# EAGLE design PennyMan_Ard_R3_Shield_v8 (EAGLE 7.6.0)
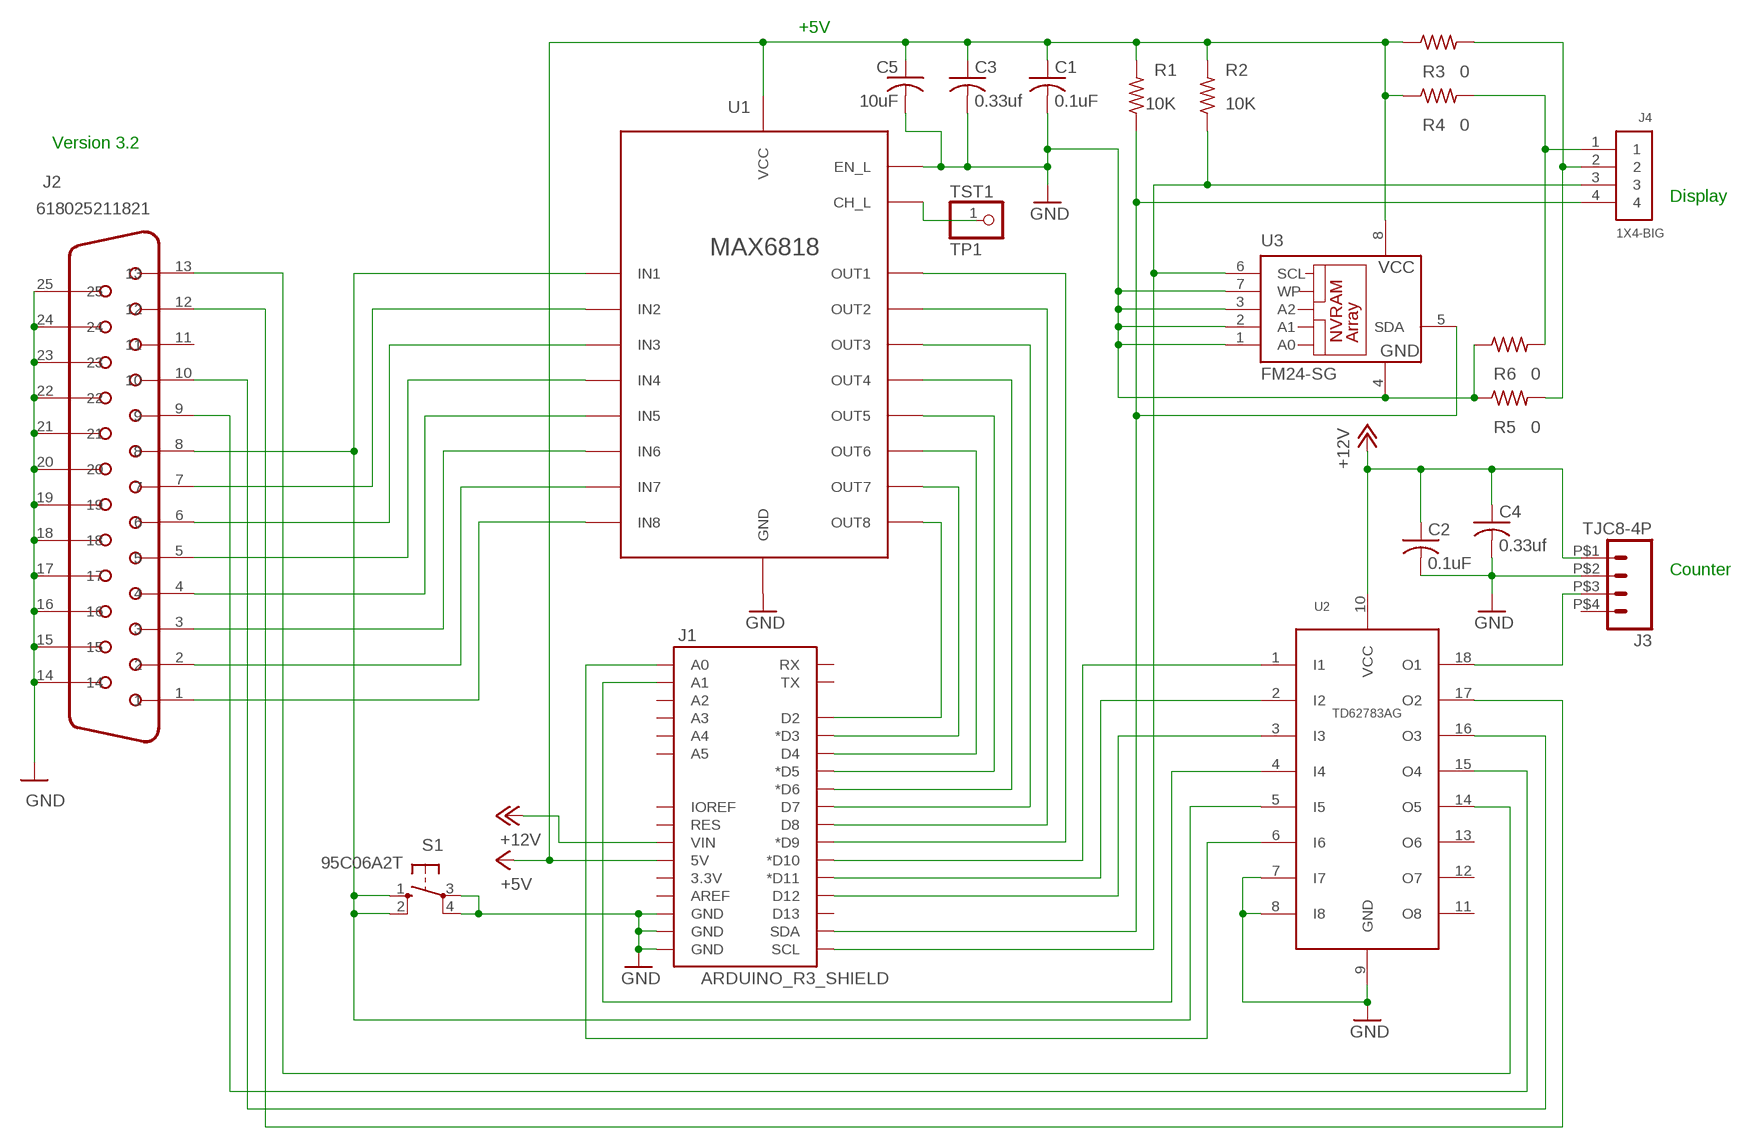
[diagram p0: schematic, sheet 1]

## Parts
C1  0.1uF  C-USC0805  [C0805]
C2  0.1uF  C-USC0805  [C0805]
C3  0.33uf  C-USC1206  [C1206]
C4  0.33uf  C-USC1206  [C1206]
C5  10uF  C-USC1812  [C1812]
J1  ARDUINO_R3_SHIELD  [UNO_R3_SHIELD]
J2  618025211821  [618025211821]
J3  TJC8-4P  [TJC8-4P]
J4  1X4-BIG  [1X04-BIG]
R1  10K  R-US_R0805  [R0805]
R2  10K  R-US_R0805  [R0805]
R3  0  R-US_R0805  [R0805]
R4  0  R-US_R0805  [R0805]
R5  0  R-US_R0805  [R0805]
R6  0  R-US_R0805  [R0805]
S1  95C06A2T  10-XX  [B3F-10XX]
TST1  TP1  PINHD-1X1  [1X01]
U1  MAX6818  [SSOP20]
U2  TD62783AG  [SOP18]
U3  FM24-SG  [SO8]

## Nets
+5V: C1.1 C3.1 C5.1 J1.5V R1.2 R2.2 R3.1 R4.1 U1.VCC U3.8(VCC)
+12V: C2.1 C4.1 J1.VIN J3.P$1 U2.10(VCC)
GND: C1.2 C2.2 C3.2 C4.2 C5.2 J1.GND@0(GND) J1.GND@1(GND) J1.GND@2(GND) J2.14 J2.15 J2.16 J2.17 J2.18 J2.19 J2.20 J2.21 J2.22 J2.23 J2.24 J2.25 J3.P$2 R5.1 R6.1 S1.3(P) S1.4(P1) U1.EN_L U1.GND U2.7(I7) U2.8(I8) U2.9(GND) U3.1(A0) U3.2(A1) U3.3(A2) U3.4(GND) U3.7(WP)
N$1: J2.1 U1.IN8
N$2: J2.2 U1.IN7
N$3: J2.3 U1.IN6
N$4: J2.4 U1.IN5
N$5: J2.5 U1.IN4
N$6: J2.6 U1.IN3
N$7: J2.7 U1.IN2
N$8: J1.D9(*D9) U1.OUT1
N$9: J1.D8 U1.OUT2
N$10: J1.D7 U1.OUT3
N$11: J1.D6(*D6) U1.OUT4
N$12: J1.D5(*D5) U1.OUT5
N$13: J1.D4 U1.OUT6
N$14: J1.D3(*D3) U1.OUT7
N$15: J3.P$3 U2.18(O1)
N$16: J1.D2 U1.OUT8
N$17: J1.A0 U2.6(I6)
N$18: J1.D10(*D10) U2.1(I1)
N$19: J1.D11(*D11) U2.2(I2)
N$20: J1.D12 U2.3(I3)
N$21: J1.A1 U2.4(I4)
N$22: J2.12 U2.17(O2)
N$23: J2.10 U2.16(O3)
N$24: J2.9 U2.15(O4)
N$25: TST1.1 U1.CH_L
N$26: J1.SCL J4.3 R2.1 U3.6(SCL)
N$27: J2.13 U2.14(O5)
N$28: J4.1 R4.2 R6.2
N$29: J1.SDA J4.4 R1.1 U3.5(SDA)
N$30: J4.2 R3.2 R5.2
N$32: J2.8 S1.1(S) S1.2(S1) U1.IN1 U2.5(I5)
Unconnected: J1.3.3V J1.A2 J1.A3 J1.A4 J1.A5 J1.AREF J1.D13 J1.IOREF J1.RES J1.RX J1.TX J2.11 J3.P$4 U2.11(O8) U2.12(O7) U2.13(O6)

## Notes on the sheet
- +5V
- Version 3.2
- Display
- Counter

## Library data of the parts
C1-C5 = resistor:C-US: CAPACITOR, American symbol
J1 = SparkFun-Boards:ARDUINO_R3_SHIELD: Shield form compatible with the Arduino Uno R3.
J2 = EagleLibrary_Wuerth_Elektronik_eiCan_Communication_Connectors_v4_20150113:618025211821: WR-DSUB 8.08mm Female Angled PCB Connector without Hex Screw, 25 Pins=>Code : Con_I-O_DSUB_PCB_Female_wo-screw_618025211821 <http://katalog.we-online.de/media/images/eican/Con_I-O_DSUB_PCB_Female_wo-screw_6180xx211821_pf2.jpg> Details see: http://katalog.we-online.de/en/em/618_0xx_211_821 Created 2014-07-10, Karrer Zheng 2014 (C) Würth Elektronik
J3 = NDN:TJC8-4P
J4 = adafruit:1X4: 4-pin connector
R1-R6 = resistor:R-US_: RESISTOR, American symbol
S1 = switch-omron:10-XX: OMRON SWITCH
TST1 = adafruit:PINHD-1X1: Pin header 1x1 for 0.1" spacing With round pins
U1 = NDN:MAX6818
U2 = NDN:TD62783AG: Octal High-side driver
U3 = ramtron:FM24*: I2C NVRAM 8 pin

## Net classes
0 default: clearance 0.205 mm

## Board
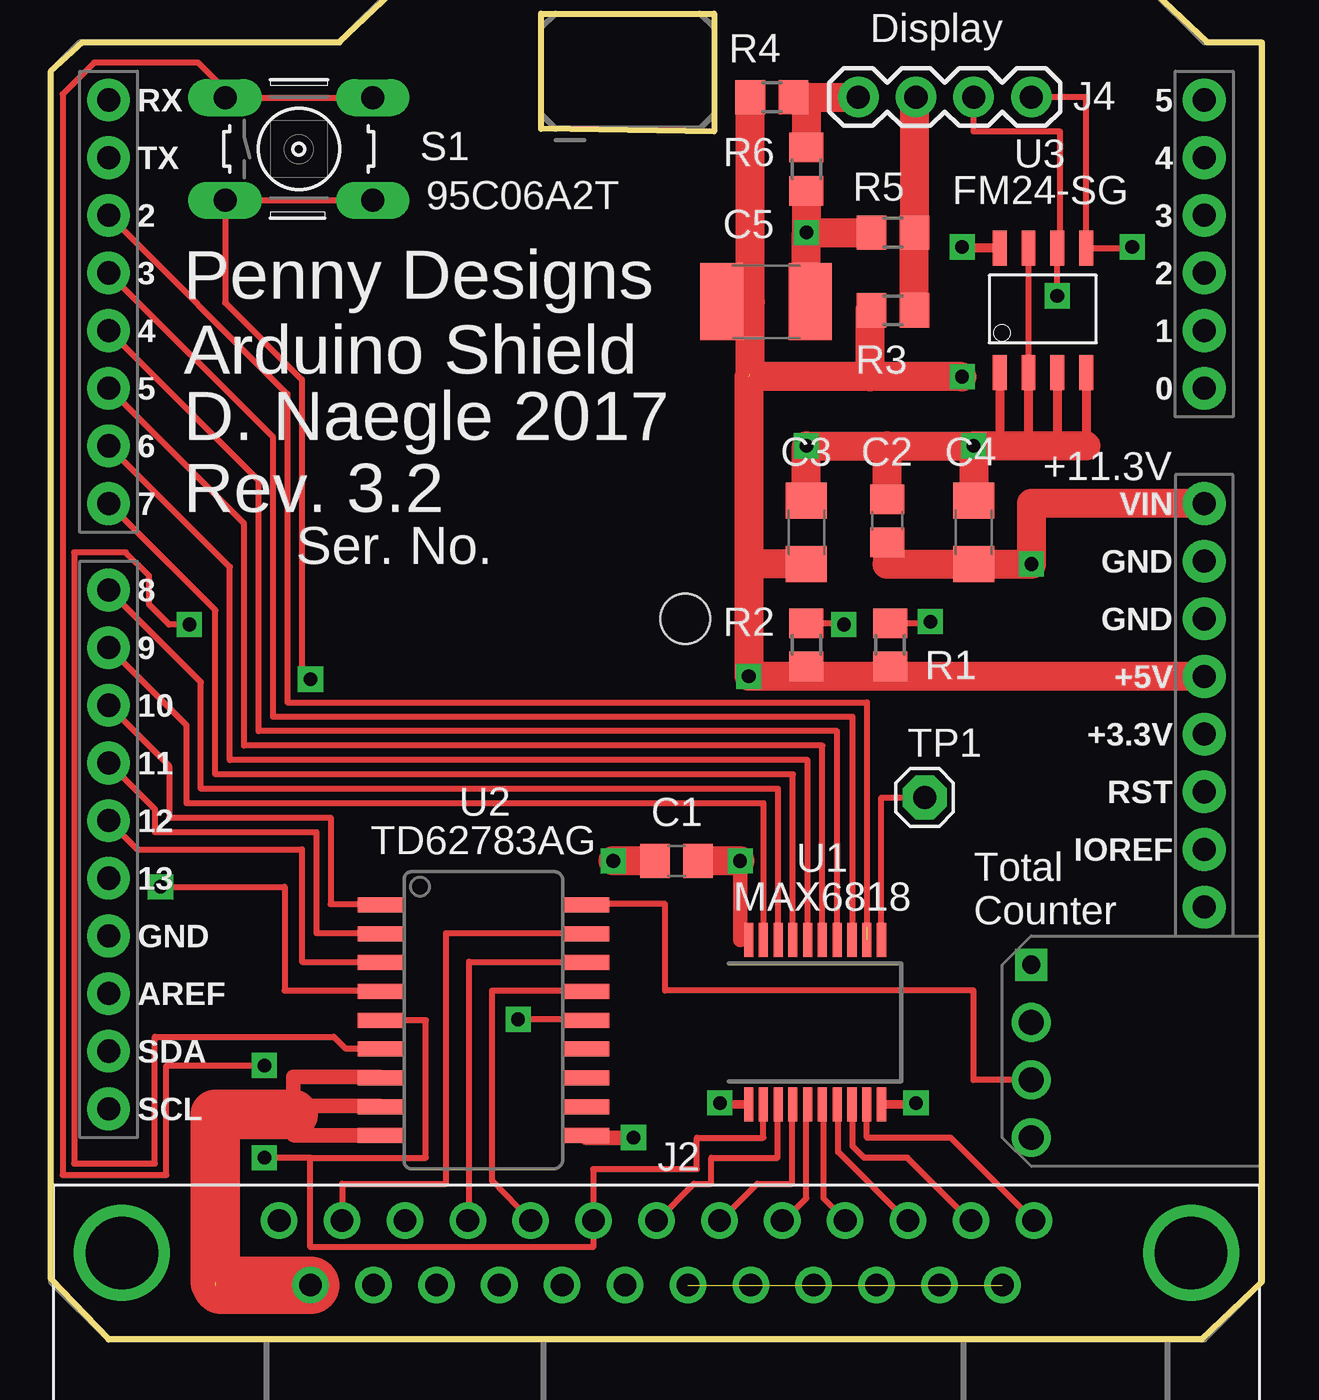
[diagram p1: board, top side]
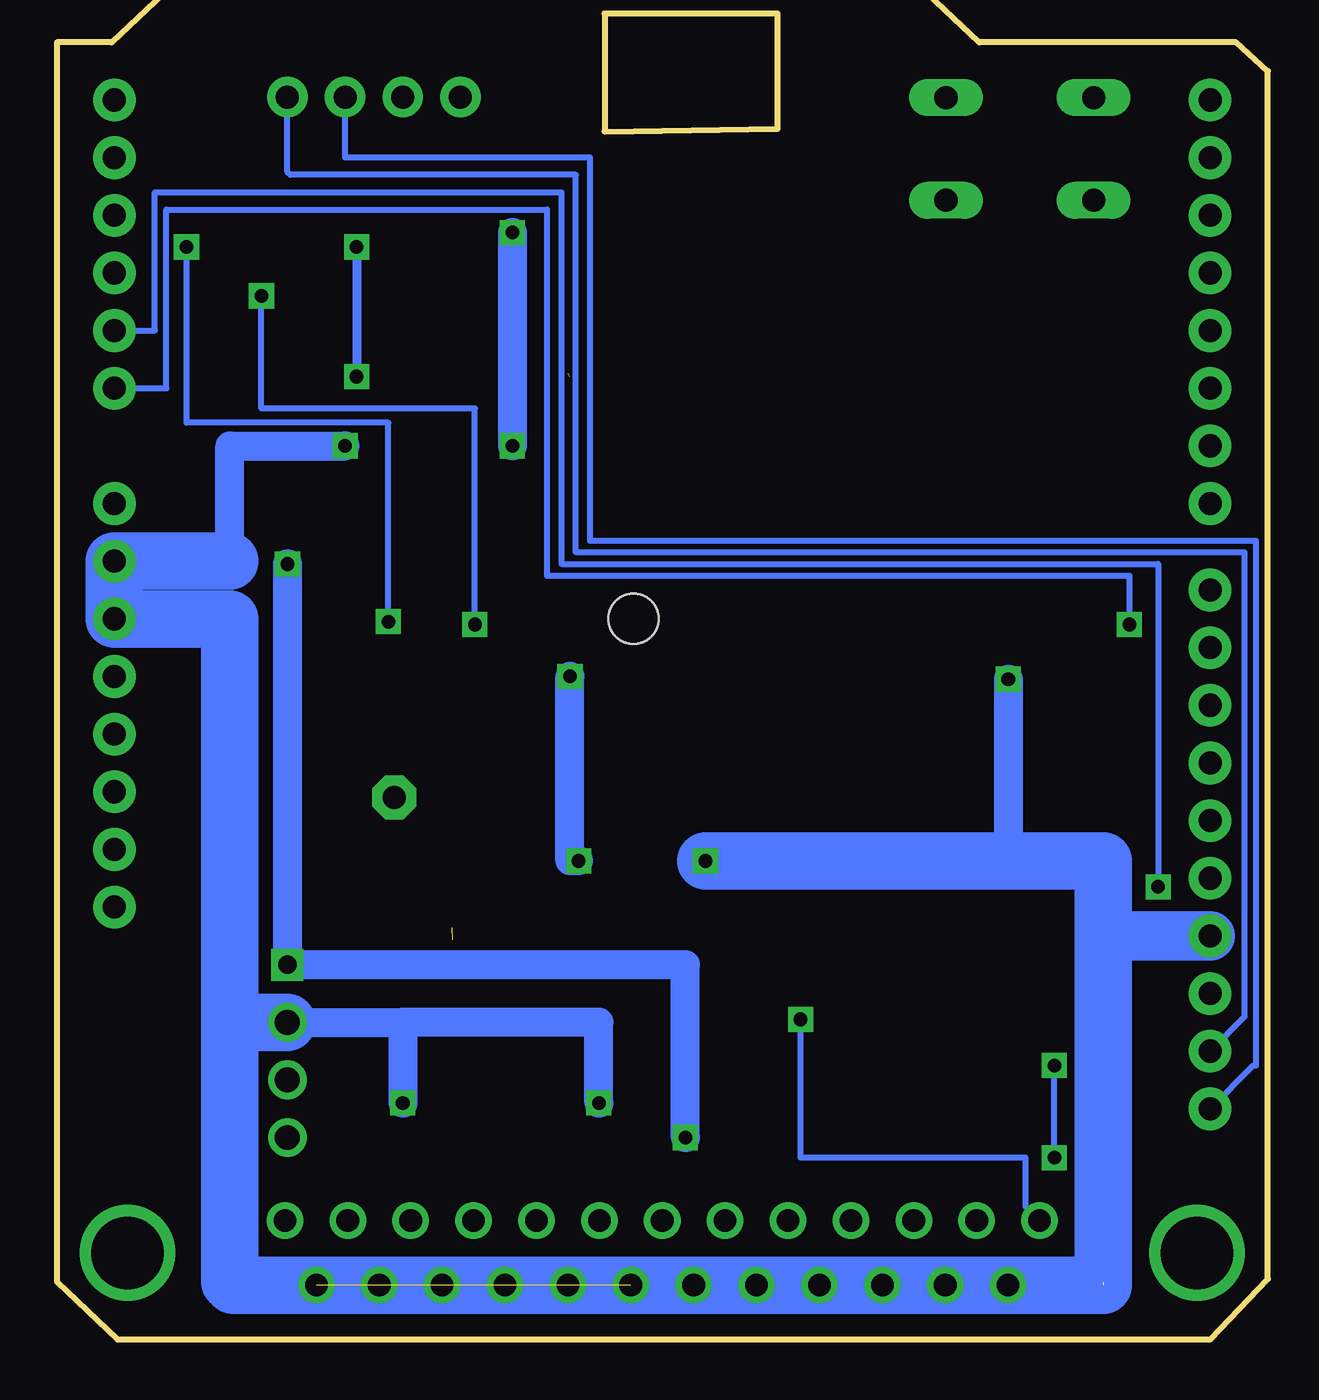
[diagram p2: board, bottom side, seen from below]

No outline drawn. Coordinates in mm, seen from the top.
Copper layers (1*16): Top 0.035mm / dielectric 1.5mm / Bottom 0.035mm
Design rules "SparkFun *": minimum track width 8mil, minimum drill 20mil, track to track 8mil, track to pad 8mil, pad to pad 8mil, via to via 8mil, smd to smd 8mil, copper to edge 10mil, drill to drill 8mil, minimum pad ring 12mil, minimum via ring 10mil, stop-mask expansion 4mil, vias tented up to drill 25mil, thermal gap 10mil
Holes 2.2 mm at 27.81,31.75

### Footprints (pad centres in the part's own frame; a part is rotated, then mirrored left to right if it is on the bottom)
C0805 = smd 1.3 x 1.5: 1 -0.95,0; 2 0.95,0
C1206 = smd 1.6 x 1.8: 1 -1.4,0; 2 1.4,0
C1812 = smd 1.9 x 3.4: 1 -1.95,0; 2 1.95,0
UNO_R3_SHIELD = drill 1.016 pad 1.88: 3.3V 50.8,26.67; 5V 50.8,29.21; A0 50.8,41.91; A1 50.8,44.45; A2 50.8,46.99; A3 50.8,49.53; A4 50.8,52.07; A5 50.8,54.61; AREF 2.54,15.24; D2 2.54,49.53; D3 2.54,46.99; D4 2.54,44.45; D5 2.54,41.91; D6 2.54,39.37; D7 2.54,36.83; D8 2.54,33.02; D9 2.54,30.48; D10 2.54,27.94; D11 2.54,25.4; D12 2.54,22.86; D13 2.54,20.32; GND@0 50.8,31.75; GND@1 50.8,34.29; GND@2 2.54,17.78; IOREF 50.8,21.59; NC 50.8,19.05; RES 50.8,24.13; RX 2.54,54.61; SCL 2.54,10.16; SDA 2.54,12.7; TX 2.54,52.07; VIN 50.8,36.83
618025211821 = drill 1: 1 16.62,1.42; 2 13.85,1.42; 3 11.08,1.42; 4 8.31,1.42; 5 5.54,1.42; 6 2.77,1.42; 7 0,1.42; 8 -2.77,1.42; 9 -5.54,1.42; 10 -8.31,1.42; 11 -11.08,1.42; 12 -13.85,1.42; 13 -16.62,1.42; 14 15.235,-1.42; 15 12.465,-1.42; 16 9.695,-1.42; 17 6.925,-1.42; 18 4.155,-1.42; 19 1.385,-1.42; 20 -1.385,-1.42; 21 -4.155,-1.42; 22 -6.925,-1.42; 23 -9.695,-1.42; 24 -12.465,-1.42; 25 -15.235,-1.42 | drill 3.2: Z1 -23.55,0; Z2 23.55,0
TJC8-4P = drill 0.8 square: P$1 -3.81,0 | drill 1.1: P$2 -1.27,0; P$3 1.27,0; P$4 3.81,0
1X04-BIG = drill 1.016 pad 1.778: 1 0,0; 2 2.54,0; 3 5.08,0; 4 7.62,0
R0805 = smd 1.3 x 1.5: 1 -0.95,0; 2 0.95,0
B3F-10XX = drill 1.016 long: 1 -3.251,2.261; 2 3.251,2.261; 3 -3.251,-2.261; 4 3.251,-2.261
1X01 = drill 1.016 pad 1.93 octagon: 1 0,0
SSOP20 = smd 0.4 x 1.5: CH_L 2.925,3.625; EN_L -2.925,-3.625; GND 2.925,-3.625; IN1 -2.275,-3.625; IN2 -1.625,-3.625; IN3 -0.975,-3.625; IN4 -0.325,-3.625; IN5 0.325,-3.625; IN6 0.975,-3.625; IN7 1.625,-3.625; IN8 2.275,-3.625; OUT1 -2.275,3.625; OUT2 -1.625,3.625; OUT3 -0.975,3.625; OUT4 -0.325,3.625; OUT5 0.325,3.625; OUT6 0.975,3.625; OUT7 1.625,3.625; OUT8 2.275,3.625; VCC -2.925,3.625
SOP18 = smd 0.66 x 2.032: 1 -3.9,-4.525; 2 -2.625,-4.525; 3 -1.36,-4.525; 4 -0.09,-4.525; 5 1.18,-4.525; 6 2.45,-4.525; 7 3.72,-4.525; 8 4.99,-4.525; 9 6.26,-4.525; 10 6.26,4.525; 11 4.99,4.525; 12 3.72,4.525; 13 2.45,4.525; 14 1.18,4.525; 15 -0.09,4.525; 16 -1.36,4.525; 17 -2.63,4.525; 18 -3.9,4.525
SO8 = smd 0.61 x 1.524: 1 -1.27,-2.743; 2 0,-2.743; 3 1.27,-2.743; 4 2.54,-2.743; 5 2.54,2.743; 6 1.27,2.743; 7 0,2.743; 8 -1.27,2.743

### Placement (x,y rotation side)
C1  27.43,21.08 180 top
C2  36.7,36.07 90 top
C3  33.15,35.56 90 top
C4  40.51,35.56 90 top
C5  31.37,45.72 0 top
J1  -0.13,0 0 top
J2  26.54,3.81 0 top
J3  43.05,12.7 270 top
J4  35.43,54.74 0 top
R1  36.83,30.61 270 top
R2  33.15,30.61 270 top
R3  36.96,45.34 0 top
R4  31.62,54.74 0 top
R5  36.96,48.77 0 top
R6  33.15,51.56 90 top
S1  10.79,52.45 0 top
TST1  38.35,23.88 0 top
U1  33.53,13.97 0 top
U2  18.92,15.24 270 top
U3  42.93,45.34 0 top

### Tracks (layer width: path | path; a pad name or v marks a point on that pad's centre or on a via)
+5V  (via drill 0.6)  (1 unrouted)
  Top 0.254: 30.23,17.59 U1.VCC | R2.2 R1.2 36.83,29.21
  Top 0.406: U3.8 40.01,48.08 v40.01,48.13
  Top 0.635: v30.23,21.08 30.23,17.59
  Top 1.27: v30.23,21.08 C1.1 | J1.5V 36.83,29.21 v30.61,29.21 30.61,34.16 | v40.01,42.42 35.94,42.42 | 35.94,42.42 30.61,42.42 30.61,34.16 | C3.1 30.61,34.16 | 30.67,42.55 30.67,45.72 | 30.67,45.72 R4.1 | R3.1 35.94,45.34 35.94,42.42 | C5.1 30.67,45.72
  Bottom 0.406: v40.01,48.13 v40.01,42.42
  Bottom 1.27: v30.23,21.08 30.61,21.08 v30.61,29.21
+12V  (via drill 0.6)
  Top 0.635: U2.10 23.45,8.89 v25.53,8.89
  Top 1.27: J1.VIN 43.05,36.83 v43.05,34.16 C4.1 36.7,34.16 C2.1
  Bottom 1.27: v43.05,34.16 J3.P$1 25.53,16.51 v25.53,8.89
GND  (via drill 0.6)  (6 unrouted)
  Top 0.254: U3.7 U3.2 | v11.3,29.08 10.92,29.46 10.92,42.29 7.54,45.67 S1.3 S1.4
  Top 0.381: U1.GND 37.9,10.35 v37.97,10.41 | U1.EN_L 29.41,10.35 v29.34,10.41
  Top 0.406: U3.1 41.66,39.37 | U3.2 42.93,39.37 | U3.3 44.2,39.37 | U3.4 45.47,39.37
  Top 0.635: U2.9 10.58,8.98 10.54,9.02 10.54,9.91 10.54,10.29 | 10.54,10.29 10.54,11.56 14.36,11.56 U2.7 | U2.8 14.36,10.29 10.54,10.29
  Top 1.27: v40.51,39.37 C4.2 | C2.2 36.7,39.37 | 36.7,39.37 v40.51,39.37 | 36.7,39.37 v33.14,39.37 C3.2 | C1.2 v24.64,21.08 | v40.51,39.37 41.66,39.37 42.93,39.37 44.2,39.37 45.47,39.37 | R6.1 v33.15,48.77 | v33.15,48.77 R5.1 | C5.2 33.15,45.72 v33.15,48.77
  Top 2.184: 10.54,9.91 7.11,9.91 7.11,2.52 7.24,2.39
  Top 2.54: 7.37,2.39 J2.25
  Bottom 0.254: 11.3,21.21 11.43,21.08
  Bottom 0.406: 45.44,2.39 45.59,2.54
  Bottom 1.27: 45.59,34.29 45.59,39.37 v40.51,39.37 | J3.P$2 37.97,13.97 | 37.97,13.97 v37.97,10.41 | v29.34,10.41 29.34,13.97 37.97,13.97 | v33.15,48.77 v33.15,39.37 v33.14,39.37 | v11.3,29.08 11.3,21.21
  Bottom 2.184: 7.11,17.78 J1.GND@2
  Bottom 2.54: 45.59,2.54 45.59,13.97 | J3.P$2 45.59,13.97 | 45.59,34.29 J1.GND@1 J1.GND@0 45.59,31.75 45.59,13.97 | 45.44,2.39 J2.19 J2.20 J2.21 J2.22 J2.23 J2.24 J2.25 7.11,2.39 7.11,17.78 7.11,21.08 11.43,21.08 v24.64,21.08
N$1
  Top 0.254: J2.1 39.5,8.89 35.81,8.89 35.81,10.33 U1.IN8
N$2
  Top 0.254: J2.2 40.36,5.23 37.59,8 35.69,8 35.18,8.51 35.18,10.32 U1.IN7
N$3
  Top 0.254: J2.3 37.57,5.23 34.54,8.26 34.54,10.3 U1.IN6
N$4
  Top 0.254: J2.4 34.85,5.28 33.91,6.22 33.91,10.29 U1.IN5
N$5
  Top 0.254: J2.5 32.15,5.23 33.15,6.22 33.15,10.29 U1.IN4
N$6
  Top 0.254: J2.6 29.36,5.23 30.99,6.86 32.51,6.86 32.51,10.3 U1.IN3
N$7
  Top 0.254: J2.7 26.57,5.23 28.19,6.86 28.96,6.86 28.96,8 31.88,8 31.88,10.32 U1.IN2
N$8
  Top 0.254: J1.D9 5.84,27.05 5.84,23.62 31.25,23.62 U1.OUT1
N$9
  Top 0.254: U1.OUT2 31.9,24.26 6.48,24.26 6.48,28.96 J1.D8
N$10
  Top 0.254: U1.OUT3 32.55,24.89 7.11,24.89 7.11,32.13 J1.D7
N$11
  Top 0.254: U1.OUT4 33.2,25.53 7.75,25.53 7.75,34.04 J1.D6
N$12
  Top 0.254: U1.OUT5 33.85,26.16 8.38,26.16 8.38,35.94 J1.D5
N$13
  Top 0.254: U1.OUT6 34.5,26.8 9.02,26.8 9.02,37.85 J1.D4
N$14
  Top 0.254: J1.D3 9.65,39.75 9.65,27.43 35.18,27.43 35.18,17.59 U1.OUT7
N$15
  Top 0.254: J3.P$3 40.51,11.43 40.51,15.37 26.92,15.37 26.92,19.18 24.13,19.18 U2.18
N$16  (1 unrouted)
  Top 0.254: J1.D2 10.29,41.66 10.29,28.07 35.81,28.07 35.81,18.16
N$17  (via drill 0.6)
  Top 0.254: v5.97,31.5 5.08,31.5 4.19,32.38 4.19,33.66 3.17,34.67 0.89,34.67 0.89,7.75 4.45,7.75 4.45,13.34 12.32,13.34 12.83,12.83 14.36,12.83 U2.6
  Bottom 0.254: v5.97,31.5 5.97,33.66 31.62,33.66 31.62,49.78 48.39,49.78 48.39,41.91 J1.A0
N$18
  Top 0.254: J1.D10 5.08,25.27 5.08,22.99 12.19,22.99 12.19,19.18 14.35,19.18 U2.1
N$19
  Top 0.254: J1.D11 4.45,23.37 4.45,22.35 11.56,22.35 11.56,17.91 13.72,17.91 U2.2
N$20
  Top 0.254: J1.D12 3.68,21.59 10.92,21.59 10.92,16.64 13.72,16.64 U2.3
N$21  (via drill 0.6)
  Top 0.254: U2.4 13.59,15.37 10.16,15.37 10.16,19.94 v4.7,19.94
  Bottom 0.254: v4.7,19.94 4.7,34.16 30.99,34.16 30.99,50.55 48.9,50.55 48.9,44.45 J1.A1
N$22
  Top 0.254: U2.17 22.86,17.91 17.27,17.91 17.27,6.86 12.7,6.86 J2.12
N$23
  Top 0.254: J2.10 18.29,5.97 18.29,16.64 22.73,16.64 U2.16
N$24
  Top 0.254: J2.9 19.3,6.99 19.3,15.37 22.86,15.37 22.86,15.33 U2.15
N$25
  Top 0.254: TST1.1 36.45,23.88 U1.CH_L
N$26  (via drill 0.6)
  Top 0.254: J4.3 40.51,53.21 44.32,53.21 44.32,48.01 44.2,48.01 U3.6 v44.2,45.97 | R2.1 34.8,31.56 v34.8,31.5
  Bottom 0.254: J4.3 40.51,52.07 29.72,52.07 29.72,35.18 0.38,35.18 0.38,12.06 0.51,12.06 J1.SCL | v34.8,31.5 34.8,41.02 44.2,41.02 v44.2,45.97
N$27  (via drill 0.6)
  Top 0.254: U2.14 23.48,14.1 v20.45,14.1
  Bottom 0.254: 9.91,5.23 J2.13 10.54,5.84 10.54,8 20.45,8 v20.45,14.1
N$28
  Top 1.27: J4.1 R4.2 33.15,54.74 R6.2
N$29  (via drill 0.6)
  Top 0.254: J4.4 45.47,54.74 U3.5 47.5,48.08 v47.5,48.13 | R1.1 38.61,31.56 v38.61,31.62
  Bottom 0.254: J1.SDA 0.89,14.22 0.89,34.67 30.35,34.67 30.35,51.31 42.93,51.31 43.05,51.44 J4.4 | v38.61,31.62 38.61,40.39 47.5,40.39 v47.5,48.13
N$30
  Top 1.27: R3.2 R5.2 37.91,54.74 J4.2
N$32  (via drill 0.6)
  Top 0.254: 14.4,14.1 U2.5 16.38,14.06 16.38,8 11.3,8 | U1.IN1 31.25,8.89 28.32,8.89 28.32,7.49 23.75,7.49 23.75,5.25 | 23.75,5.25 J2.8 | 23.75,5.25 23.75,4.06 11.3,4.06 11.3,8 | 11.3,8 v9.27,8 | v9.27,12.06 4.95,12.06 4.95,7.24 0.38,7.24 0.38,54.86 1.78,56.26 6.35,56.26 7.54,55.07 S1.1 S1.2
  Bottom 0.254: v9.27,8 v9.27,12.06

### Text on the board
tPlace: Display | Penny Designs | Arduino Shield | D. Naegle 2017 | +11.3V | Rev. 3.2 | Ser. No. | Total / Counter